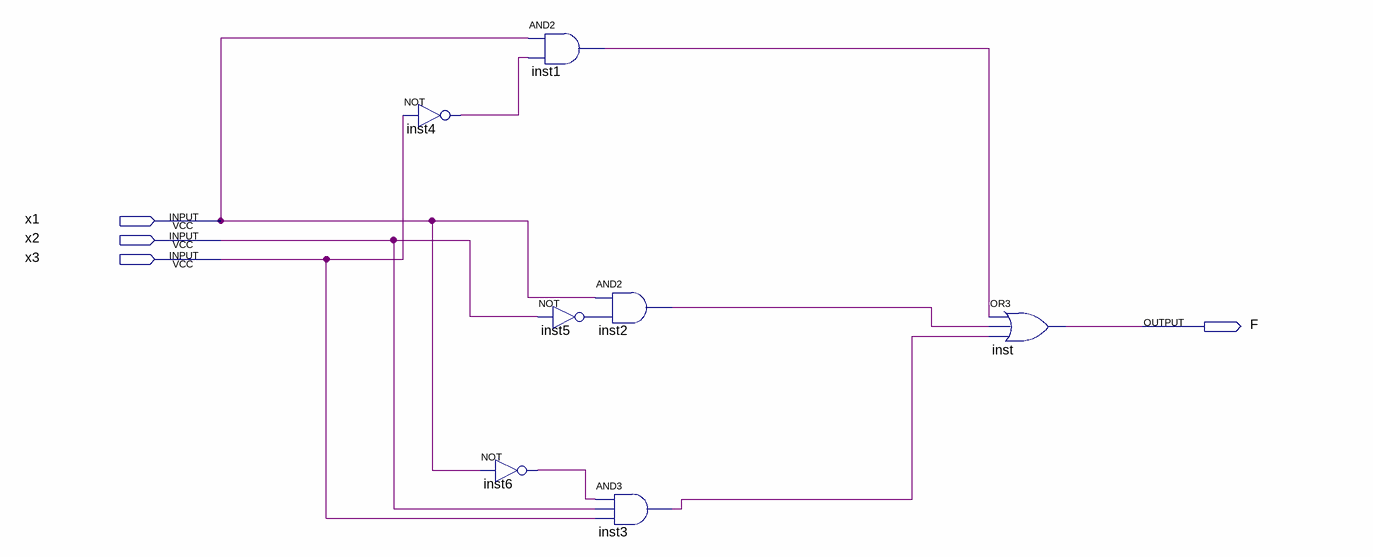
[diagram p0: schematic sheet]
// Quartus schematic traffic_controller_top_level.bdf as structural Verilog: 7 symbols, 4 pins
module traffic_controller_top_level (
  input  x1,
  input  x2,
  input  x3,
  output F
);

  wire inst1_out, inst2_out, inst3_out, inst4_out, inst5_out, inst6_out;

  not inst4 (inst4_out, x3);
  not inst6 (inst6_out, x1);
  and inst1 (inst1_out, x1, inst4_out);
  not inst5 (inst5_out, x2);
  and inst2 (inst2_out, x1, inst5_out);
  and inst3 (inst3_out, inst6_out, x2, x3);
  or inst (F, inst1_out, inst2_out, inst3_out);
endmodule
